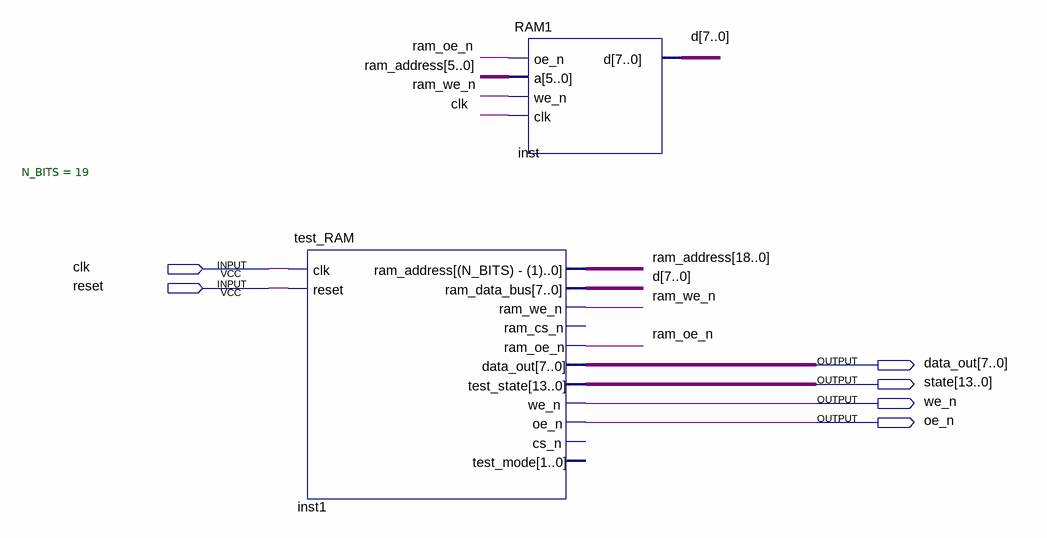
[diagram p0: schematic sheet]
// Quartus schematic test_com_ram.bdf as structural Verilog: 2 symbols, 6 pins
module test_com_ram (
  input  clk,
  input  reset,
  output [7:0] data_out,
  output [13:0] state,
  output we_n,
  output oe_n
);

  wire ram_oe_n, ram_we_n;
  wire [7:0] d;
  wire [18:0] ram_address;

  test_RAM #(.N_BITS(19)) inst1 (
    .clk(clk), .reset(reset), .ram_address(ram_address), .ram_we_n(ram_we_n), .ram_oe_n(ram_oe_n),
    .data_out(data_out), .test_state(state), .we_n(we_n), .oe_n(oe_n), .ram_data_bus(d));  // open: ram_cs_n, cs_n, test_mode
  RAM1 inst (.oe_n(ram_oe_n), .a(ram_address[5:0]), .we_n(ram_we_n), .clk(clk), .d(d));
endmodule
